# EAGLE design uCoNo (EAGLE 5.11)
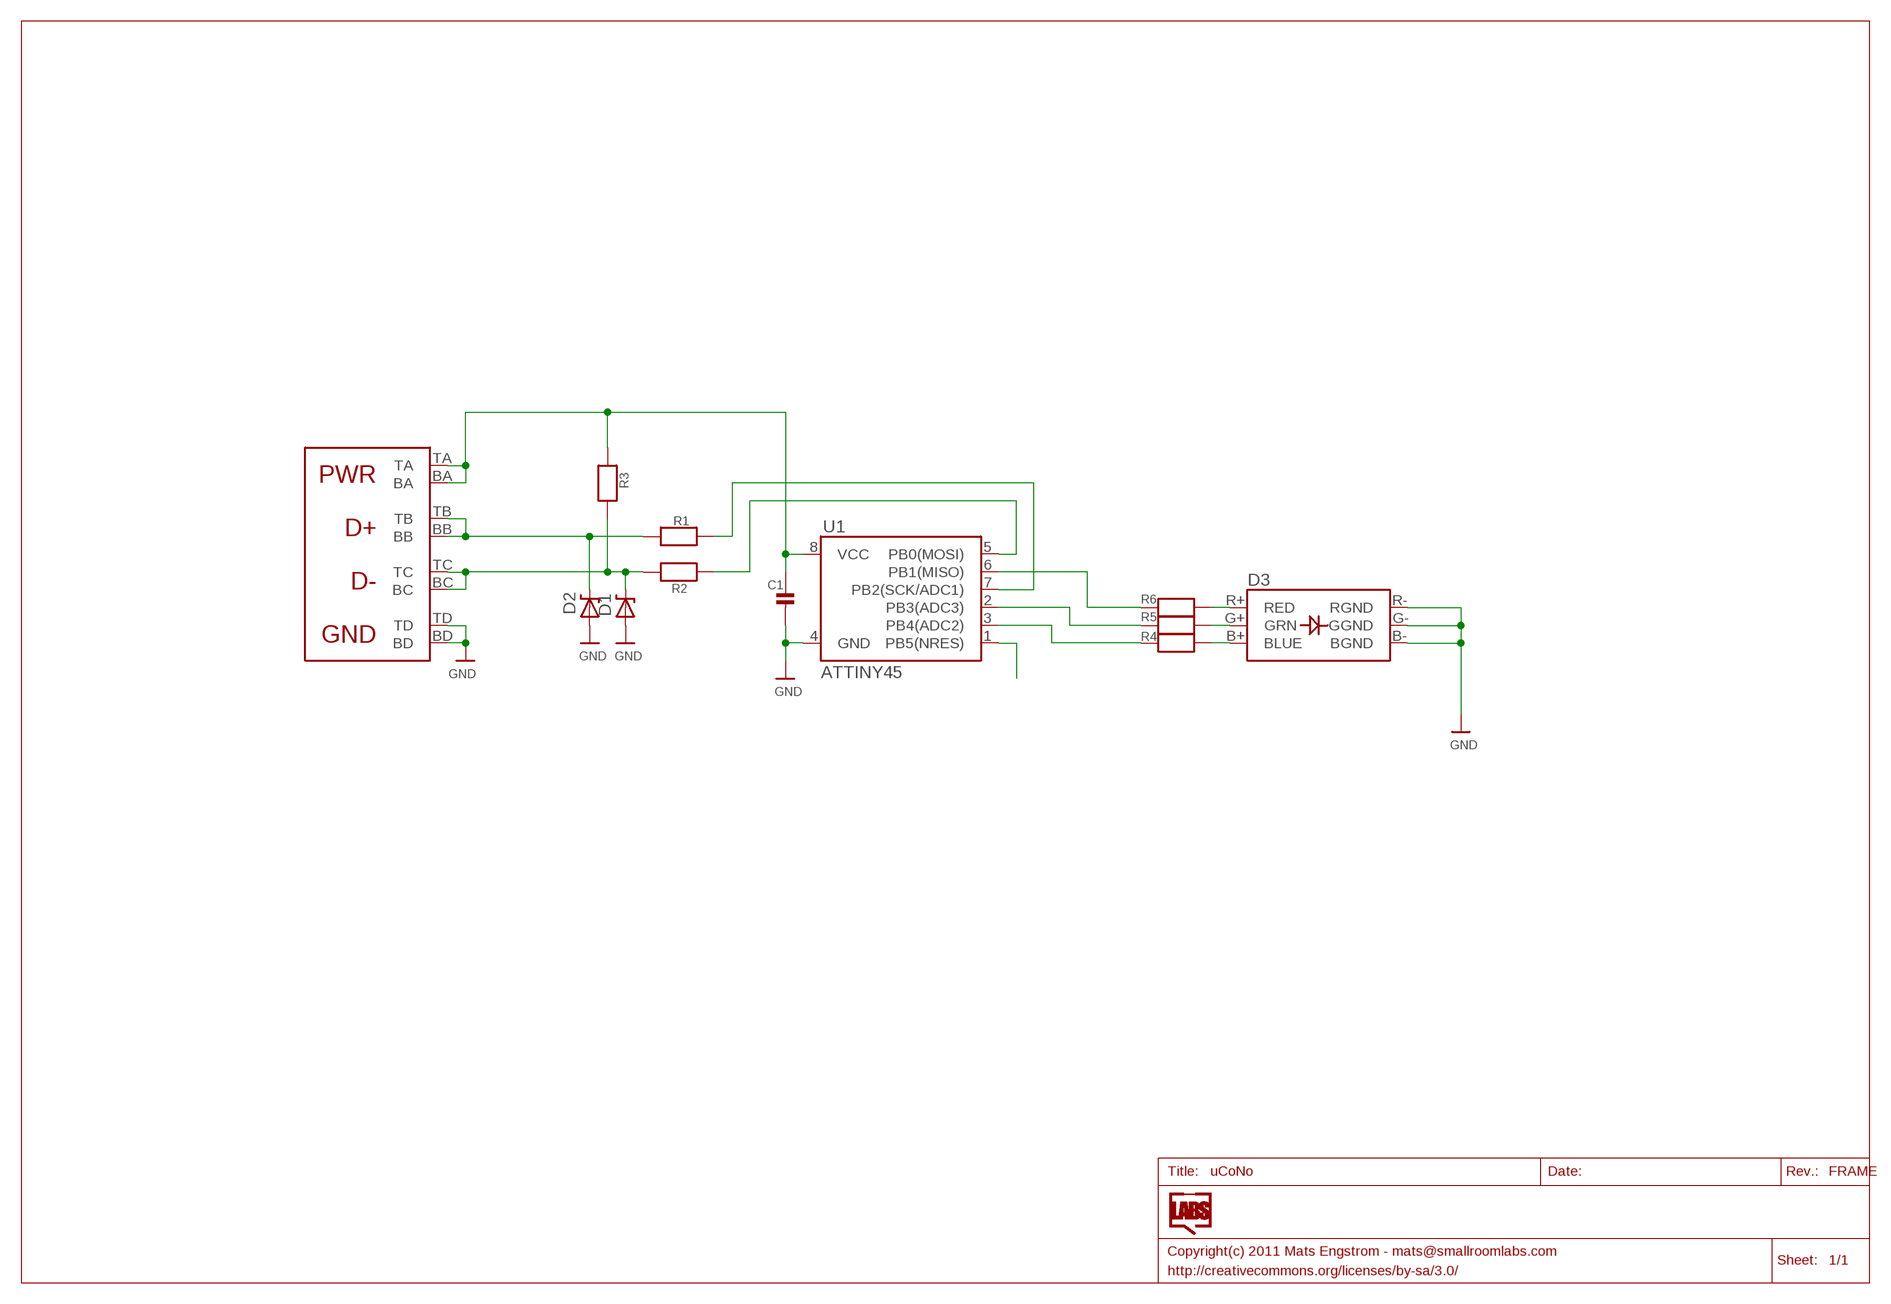
[diagram p0: schematic, sheet 1]

## Parts
C1  CAP_CERAMIC0603  [0603]
CN1  USB-2LAYERMC32604  [MC32604]
D1  DIODE-ZENER-BZT52  [SOD-323]
D2  DIODE-ZENER-BZT52  [SOD-323]
D3  RGB6L  [RGB-PLCC6L]
R1  RESISTOR0603  [0603]
R2  RESISTOR0603  [0603]
R3  RESISTOR0603  [0603]
R4  RESISTOR0603  [0603]
R5  RESISTOR0603  [0603]
R6  RESISTOR0603  [0603]
U1  ATTINY45  [SO08-EIAJ]

## Nets
BLUE: R4.1 U1.3(PB4(ADC2))
BLUEA: D3.B+(BLUE) R4.2
D+: CN1.BB CN1.TB D2.1(C) R1.1
D-: CN1.BC CN1.TC D1.1(C) R2.1 R3.1
DATA+_SCK: R1.2 U1.7(PB2(SCK/ADC1))
DATA-_MOSI: R2.2 U1.5(PB0(MOSI))
GND: C1.2 CN1.BD CN1.TD D1.2(A) D2.2(A) D3.B-(BGND) D3.G-(GGND) D3.R-(RGND) U1.4(GND)
GREEN: R5.1 U1.2(PB3(ADC3))
GREENA: D3.G+(GRN) R5.2
RED_MISO: R6.1 U1.6(PB1(MISO))
REDA: D3.R+(RED) R6.2
RES: U1.1(PB5(NRES))
VCC: C1.1 CN1.BA CN1.TA R3.2 U1.8(VCC)

## Library data of the parts
C1 = microbuilder:CAP_CERAMIC: Ceramic Capacitors 0402 - 0402 Surface Mount Capacitors 0.1uF 10V 10% [Digikey: 490-1318-2-ND] 0603 - 0603 Surface Mount Capacitors 16 pF 50V 5% [Digikey: 445-5051-2-ND] 22 pF 50V [Digikey: PCC220ACVTR-ND] 33 pF 50V 5% [Digikey: 490-1415-1-ND] 56pF 50V 5% [Digikey: 490-1421-1-ND] 220pF 50V 5% [Digikey: 445-1285-1-ND] 680 pF 50V 2200 pF 50V 5% C0G [Digikey: 445-1297-1-ND] 5600 pF 100V 5% X7R [Digikey: 478-3711-1-ND] 0.1 µF 25V 10% [Digikey: PCC2277TR-ND] 0.22 µF 16V 10% X7R [Digikey: 445-1318-1-ND] 1.0 µF 25V 10% [Digikey: 445-5146-2-ND] 0603 - RF Specific 3pF 250V +/-0.1pF RF [Digikey: 712-1347-1-ND] 18 pF 250V 5% [Digikey: 478-3505-1-ND or 712-1322-1-ND] 56 pF 250V 5% C0G RF [Digikey: 490-4867-1-ND] 68 pF 250V RF [Digikey: 490-4868-1-ND] 0805 - 0805 Surface Mount Capacitors 220 pF 250V 2% RF Ceramic Capacitor [Digikey: 712-1398-1-ND] 1000 pF 50V 2% NP0 Ceramic Capacitor [Digikey: 478-3760-1-ND] 0.1 µF 25V 10% Ceramic Capacitor [Digikey: PCC1828TR-ND] 1.0 µF 16V 10% Ceramic Capacitor[Digikey: 490-1691-2-ND] 10.0 µF 10V 10% Ceramic Capacitor[Digikey: 709-1228-1-ND] 1206 - 1206 Surface Mount Capacitors
CN1 = SmallRoomLabs:USB-2LAYER
D1 D2 = SparkFun:DIODE-ZENER: Zener Diode Production Part - 8199 3.4V Zener Voltage
D3 = SmallRoomLabs:RGB6
R1-R6 = microbuilder:RESISTOR: Resistors 0402 - 0402 Surface Mount Package 10.0K 1% 1/16W [Digikey: 311-10.0KLRTR-ND] 0603 - 0603 Surface Mount Package 0 Ohm 1/10 Watt 1% Resistor 15 Ohm 1/10 Watt 1% Resistor 33 Ohm 1/10 Watt 1% Resistor 49.9 Ohm 1/10 Watt 1% Resistor 100 Ohm 1/10 Watt 1% Resistor 150 Ohm 1/10 Watt 1% Resistor 240 Ohm 1/10 Watt 1% Resistor 390 Ohm 1/10 Watt 1% Resistor 560 Ohm 1/10 Watt 1% Resistor 750 Ohm 1/10 Watt 1% Resistor 1.0K Ohm 1/10 Watt 1% Resistor 1.5K Ohm 1/10 Watt 1% Resistor 2.0K Ohm 1/10 Watt 1% Resistor 4.7K Ohm 1/10 Watt 1% Resistor 10.0K Ohm 1/10 Watt 1% Resistor 20.0K Ohm 1/10 Watt 1% Resistor 33.0K Ohm 1/10 Watt 1% Resistor 100.0K Ohm 1/10 Watt 1% Resistor 0805 - 0805 Surface Mount Package 0 Ohm 1/8 Watt 1% Resistor 33 Ohm 1/8 Watt 1% Resistor 100 Ohm 1/8 Watt 1% Resistor 150 Ohm 1/8 Watt 1% Resistor 200 Ohm 1/8 Watt 1% Resistor 240 Ohm 1/8 Watt 1% Resistor 330 Ohm 1/8 Watt 1% Resistor 390 Ohm 1/8 Watt 1% Resistor 470 Ohm 1/8 Watt 1% Resistor 1.0K Ohm 1/8 Watt 1% Resistor 1.5K Ohm 1/8 Watt 1% Resistor 2.0K Ohm 1/8 Watt 1% Resistor 4.7K Ohm 1/8 Watt 1% Resistor 5.1K Ohm 1/8 Watt 1% Resistor 5.6K Ohm 1/8 Watt 1% Resistor 10.0K Ohm 1/8 Watt 1% Resistor 22.0K Ohm 1/8 Watt 1% Resistor 33.0K Ohm 1/8 Watt 1% Resistor 100K Ohm 1/8 Watt 1% Resistor 1206 - 1206 Surface Mount Package
U1 = SparkFun:ATTINY45: Atmel ATTiny45

## Net classes
0 default: width 0.178 mm, drill 0.305 mm, clearance 0.178 mm

## Board
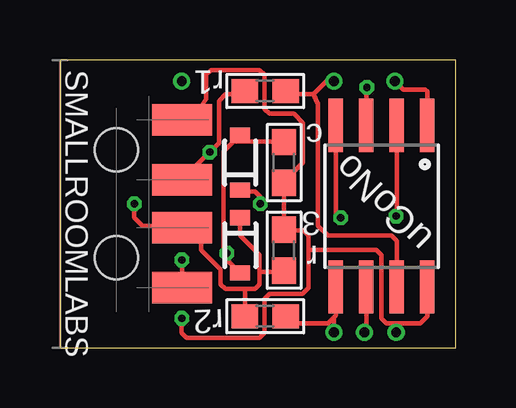
[diagram p1: board, top side]
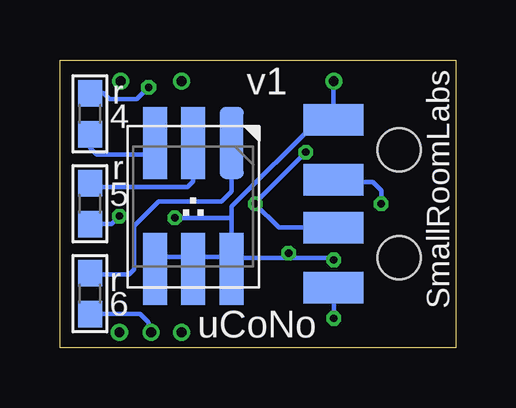
[diagram p2: board, bottom side, seen from below]

Size 16.5 x 12 mm. Coordinates in mm from the lower left corner, seen from the top.
Outline: 0,0 16.5,0 16.5,12 0,12 0,0
Copper layers (1*16): Top 0.035mm / dielectric 1.5mm / Bottom 0.035mm
Design rules "Fusion_eagle_rule_v1.1": minimum track width 6mil, minimum drill 12mil, track to track 6mil, track to pad 6mil, pad to pad 6mil, via to via 6mil, smd to smd 0mil, copper to edge 10mil, drill to drill 10mil, minimum pad ring 10mil, minimum via ring 6mil, stop-mask expansion 2mil, vias tented up to drill 100mil, thermal gap 10mil

### Footprints (pad centres in the part's own frame; a part is rotated, then mirrored left to right if it is on the bottom)
0603 = smd 1.1 x 1: 1 -0.85,0; 2 0.85,0
MC32604 = smd 1.3 x 2.5 bottom: BA 3.5,5.1; BB 1,5.1; BC -1,5.1; BD -3.5,5.1 | smd 1.3 x 2.5: TA -3.5,5.1; TB -1,5.1; TC 1,5.1; TD 3.5,5.1 | hole 1.8: -2.25,2.35; 2.25,2.35
SOD-323 = smd 0.63 x 0.83: 1 -1.15,0; 2 1.15,0
RGB-PLCC6L = smd 1 x 3: B+ 1.6,-2.658; B- 1.6,2.608; G+ 0,-2.658; G- 0,2.608; R+ -1.6,-2.658; R- -1.6,2.608
SO08-EIAJ = smd 0.61 x 2.21: 1 -1.905,-3.378; 2 -0.635,-3.378; 3 0.635,-3.378; 4 1.905,-3.378; 5 1.905,3.353; 6 0.635,3.353; 7 -0.635,3.353; 8 -1.905,3.353

### Placement (x,y rotation side)
C1  9.35,7.72 90 top
CN1  0,6 270 top
D1  7.52,4.27 270 top
D2  7.52,7.72 90 top
D3  10.94,5.88 180 bottom
R1  8.56,10.7 0 top
R2  8.56,1.31 0 top
R3  9.35,4.06 90 top
R4  15.25,9.75 270 bottom
R5  15.25,6 90 bottom
R6  15.25,2.25 90 bottom
U1  13.41,5.89 180 top

### Tracks (layer width: path | path; a pad name or v marks a point on that pad's centre or on a via)
BLUE  (via drill 0.3)
  Top 0.178: U1.3 12.78,10.83 v12.8,10.86
  Bottom 0.178: R4.1 15.24,10.62 14.68,10.62 14.43,10.36 13.3,10.36 v12.8,10.86
BLUEA
  Bottom 0.178: D3.B+ 12.55,8.05 14.96,8.05 15.24,8.33 R4.2
D+  (via drill 0.3)
  Top 0.178: 7.52,6.55 D2.1 7.59,6.5 8.13,6.5 8.36,6.27 v8.36,5.99 | 7.7,10.69 R1.1 7.57,10.57 6.91,10.57 6.63,10.29 6.63,8.53 v6.25,8.15 CN1.TB
  Bottom 0.178: CN1.BB 7.37,5 v8.36,5.99 8.33,6.07 v6.25,8.15
D-  (via drill 0.3)
  Top 0.178: 9.35,3.23 R3.1 9.3,3.15 8.33,3.15 | 7.72,1.32 R2.1 7.71,2.43 7.72,2.44 | CN1.TC 5.11,4.98 | CN1.TC 5.03,5.05 5,5.08 3.45,5.08 3.1,5.44 v3.1,5.99 | D1.1 7.52,4.67 8.33,3.86 8.33,3.15 | 8.33,3.15 8.33,2.64 8.13,2.44 7.72,2.44 | 7.72,2.44 6.91,2.44 6.71,2.64 6.71,3.25 5.89,4.06 5.89,4.88 5.22,4.88 CN1.TC
  Bottom 0.178: CN1.BC 5.08,6.99 5,6.91 3.45,6.91 3.1,6.55 v3.1,5.99
DATA+_SCK  (via drill 0.41)
  Top 0.178: 9.68,10.57 9.55,10.57 9.42,10.69 R1.2 9.55,10.57 10.57,10.57 | U1.7 14.05,4.45 13.82,4.67 11.18,4.67 10.77,5.08 10.77,10.16 10.57,10.57 | v11.43,11.11 11.11,11.11 10.57,10.57
DATA-_MOSI  (via drill 0.41)
  Top 0.178: R2.2 9.42,1.32 9.73,1.02 11.18,1.02 11.43,1.27 | 11.43,1.27 11.51,1.35 U1.5 | 11.43,1.27 v11.43,0.64
GND  (via drill 0.3, 0.41)
  Top 0.178: 6.83,3.94 6.83,8.18 D2.2 7.34,8.59 9.35,8.59 C1.2 | 6.83,3.94 6.83,3.81 D1.2 | v6.96,3.94 6.83,3.94 | v5.08,3.66 5.1,3.66 CN1.TD | U1.4 11.51,5.62 v11.71,5.41
  Bottom 0.178: D3.R- 9.35,3.79 10.92,3.79 D3.G- | 12.52,3.79 D3.B- 12.53,3.79 11.02,3.79 D3.G- | 6.96,3.73 9.27,3.73 D3.R- | CN1.BD | D3.R- 8.94,3.81 | v6.96,3.94 6.96,3.73 | CN1.BD 5.71,9.5 9.34,5.88 9.34,5.49 | 6.96,3.73 5.08,3.73 v5.08,3.66 | D3.G- 10.97,3.81 | D3.R- 9.34,5.49 | v11.71,5.41 9.41,5.41 9.34,5.49 | CN1.BD 5.1,11.09 v5.08,11.11
GREEN  (via drill 0.3)
  Top 0.178: U1.2 14.05,5.51 v14.02,5.49
  Bottom 0.178: R5.1 14.35,5.16 v14.02,5.49
GREENA
  Bottom 0.178: 15.16,6.76 15.24,6.83 R5.2 15.11,6.71 11.18,6.71 10.95,6.93 10.95,8.03 D3.G+
RED_MISO  (via drill 0.41)
  Top 0.178: U1.6 12.78,0.71 v12.7,0.64
  Bottom 0.178: R6.1 13.15,1.4 12.83,1.08 v12.7,0.64
REDA
  Bottom 0.178: 9.35,7.75 9.35,8.03 D3.R+ 9.34,6.51 9.75,6.1 12.39,6.1 13.41,5.08 13.41,3.25 13.61,3.05 15.16,3.05 15.24,3.12 R6.2
RES  (via drill 0.41)
  Top 0.178: U1.1 15.32,10.69 15.24,10.77 14.31,10.77 v13.97,11.11
VCC  (via drill 0.3, 0.41)
  Top 0.178: R3.2 C1.1 9.37,6.96 10.13,7.72 10.13,9.37 9.75,9.75 8.74,9.75 8.53,9.96 8.53,11.38 8.33,11.58 6.3,11.58 6.1,11.38 6.1,10.36 5.69,9.75 5.35,9.75 CN1.TA 5.11,9.53 | R3.2 9.42,4.88 10.16,4.88 10.36,4.67 10.36,4.06 | R3.2 9.38,4.88 | U1.8 15.32,1.29 15.04,1.02 14.02,1.02 | 14.02,1.02 13.61,1.02 13.41,1.22 13.41,3.86 13.21,4.06 10.36,4.06 | 10.36,4.06 10.36,2.49 10.11,2.23 8.74,2.23 8.53,2.03 8.53,0.61 8.33,0.41 5.28,0.41 5.08,0.61 v5.08,1.22 | 14.02,1.02 v14.02,0.64
  Bottom 0.178: CN1.BA 5.11,2.49 5.28,2.31 5.08,2.31 v5.08,1.22

### Text on the board
tPlace: SMALLROOMLABS | r1 | c | 3 | uCoNo | r | r2
bPlace: SmallRoomLabs | v1 | r | 4 | r | 5 | r | 6 | uCoNo